# EasyEDA schematic Schematic_sram_dram_mosfet.json
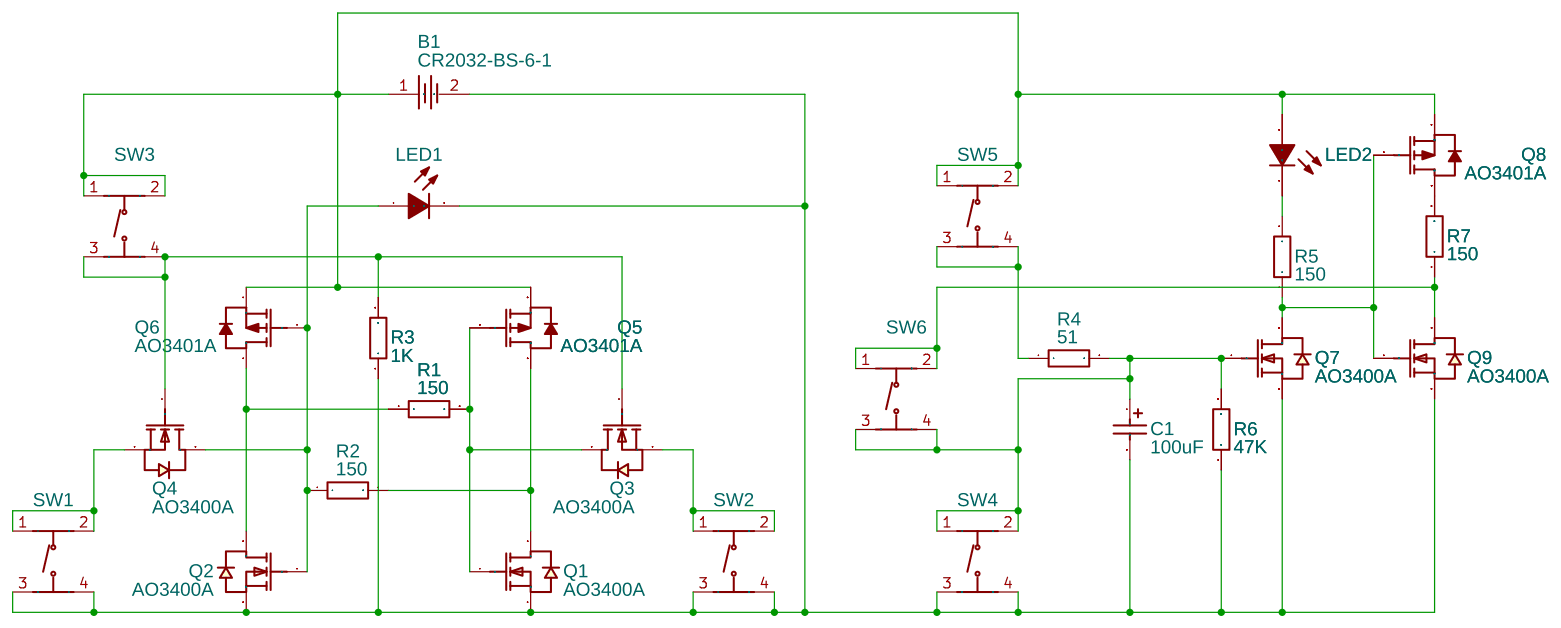
[diagram p0: schematic sheet]

## Parts
B1  CR2032-BS-6-1  [BAT-TH_CR2032-BS-6-1]
C1  100uF  [CAP-SMD_L3.5-W2.8]
LED1  19-213/Y2C-CQ2R2L/3T(CY)  [LED0603-R-RD]
LED2  19-213/Y2C-CQ2R2L/3T(CY)  [LED0603-R-RD]
Q1  AO3400A  [SOT-23-3_L2.9-W1.6-P1.90-LS2.8-BR]
Q2  AO3400A  [SOT-23-3_L2.9-W1.6-P1.90-LS2.8-BR]
Q3  AO3400A  [SOT-23-3_L2.9-W1.6-P1.90-LS2.8-BR]
Q4  AO3400A  [SOT-23-3_L2.9-W1.6-P1.90-LS2.8-BR]
Q5  AO3401A  [SOT-23_L2.9-W1.3-P0.95-LS2.4-BR]
Q6  AO3401A  [SOT-23_L2.9-W1.3-P0.95-LS2.4-BR]
Q7  AO3400A  [SOT-23-3_L2.9-W1.6-P1.90-LS2.8-BR]
Q8  AO3401A  [SOT-23_L2.9-W1.3-P0.95-LS2.4-BR]
Q9  AO3400A  [SOT-23-3_L2.9-W1.6-P1.90-LS2.8-BR]
R1  150  [R0603]
R2  150  [R0603]
R3  1K  [R0603]
R4  51  [R0603]
R5  150  [R0603]
R6  47K  [R0603]
R7  150  [R0603]
SW1  TS-1187A-B-A-B  [SW-SMD_4P-L5.1-W5.1-P3.70-LS6.4]
SW2  TS-1187A-B-A-B  [SW-SMD_4P-L5.1-W5.1-P3.70-LS6.4]
SW3  TS-1187A-B-A-B  [SW-SMD_4P-L5.1-W5.1-P3.70-LS6.4]
SW4  TS-1187A-B-A-B  [SW-SMD_4P-L5.1-W5.1-P3.70-LS6.4]
SW5  TS-1187A-B-A-B  [SW-SMD_4P-L5.1-W5.1-P3.70-LS6.4]
SW6  TS-1187A-B-A-B  [SW-SMD_4P-L5.1-W5.1-P3.70-LS6.4]

## Library data of the parts
B1 = CR2032-BS-6-1: Supplier: LCSC; Manufacturer: Q&J; image: //image.lceda.cn/szlcsc/C70377.jpg; Supplier Part: C70377; SMT Type: Extend; JLCPCB SMD: Yes
C1 = TAJB107K006RNJ: Supplier: LCSC; Manufacturer: AVX; Supplier Part: C16133; SMT Type: Basic; JLCPCB SMD: Yes
LED1 LED2 = 19-213/Y2C-CQ2R2L/3T(CY): Supplier: LCSC; Manufacturer: EVERLIGHT; image: //image.lceda.cn/szlcsc/C72038.jpg; Supplier Part: C72038; SMT Type: Basic; JLCPCB SMD: Yes
Q1-Q4 Q7 Q9 = AO3400A: Supplier: LCSC; Manufacturer: AOS; image: //image.lceda.cn/szlcsc/C20917.jpg; Supplier Part: C20917; SMT Type: Basic; JLCPCB SMD: Yes
Q5 Q6 Q8 = AO3401A: Supplier: LCSC; Manufacturer: AOS; image: //image.lceda.cn/szlcsc/C15127.jpg; Supplier Part: C15127; SMT Type: Basic; JLCPCB SMD: Yes
R1 R2 R7 = 0603WAF1500T5E: Supplier: LCSC; Manufacturer: UniOhm; Supplier Part: C22808; SMT Type: Basic; JLCPCB SMD: Yes
R3 = 0603WAF1001T5E: Supplier: LCSC; Manufacturer: UniOhm; Supplier Part: C21190; SMT Type: Basic; JLCPCB SMD: Yes
R4 = 0603WAF1500T5E: Supplier: LCSC; Manufacturer: UniOhm; Manufacturer Part: 0603WAF510JT5E; Supplier Part: C23197; SMT Type: Basic; JLCPCB SMD: Yes; Package Display: No
R5 = 0603WAF510JT5E: Supplier: LCSC; Manufacturer: UniOhm; Manufacturer Part: 0603WAF1500T5E; Supplier Part: C22808; SMT Type: Basic; JLCPCB SMD: Yes; Package Display: No
R6 = 0603WAF2702T5E: Supplier: LCSC; Manufacturer: UniOhm; Manufacturer Part: 0603WAF4702T5E; Supplier Part: C25819; SMT Type: Basic; JLCPCB SMD: Yes; Package Display: No
SW1-SW6 = TS-1187A-B-A-B: Supplier: LCSC; Supplier Part: C318884; Manufacturer: XKB Enterprise; Contributor: LCSC; SMT Type: Extend; JLCPCB SMD: Yes

## Nets
Net-(B1-1): B1.1 LED2.1(A) Q5.2(S) Q6.2(S) Q8.2(S) SW3.1(A) SW3.2(B) SW5.1(A) SW5.2(B)
Net-(B1-2): B1.2 C1.2 LED1.2(C) Q1.2(S) Q2.2(S) Q7.2(S) Q9.2(S) R3.1 R6.1 SW1.3(C) SW1.4(D) SW2.3(C) SW2.4(D) SW4.3(C) SW4.4(D)
Net-(C1-1): C1.1 Q7.1(G) R4.2 R6.2 SW4.1(A) SW4.2(B) SW6.3(C) SW6.4(D)
Net-(LED1-1): LED1.1(A) Q2.1(G) Q4.3(D) Q6.1(G) R2.1
Net-(LED2-2): LED2.2(C) R5.2
Net-(Q1-1): Q1.1(G) Q3.3(D) Q5.1(G) R1.2
Net-(Q1-3): Q1.3(D) Q5.3(D) R2.2
Net-(Q2-3): Q2.3(D) Q6.3(D) R1.1
Net-(Q3-1): Q3.1(G) Q4.1(G) R3.2 SW3.3(C) SW3.4(D)
Net-(Q3-2): Q3.2(S) SW2.1(A) SW2.2(B)
Net-(Q4-2): Q4.2(S) SW1.1(A) SW1.2(B)
Net-(Q7-3): Q7.3(D) Q8.1(G) Q9.1(G) R5.1
Net-(Q8-3): Q8.3(D) R7.2
Net-(Q9-3): Q9.3(D) R7.1 SW6.1(A) SW6.2(B)
Net-(R4-1): R4.1 SW5.3(C) SW5.4(D)
